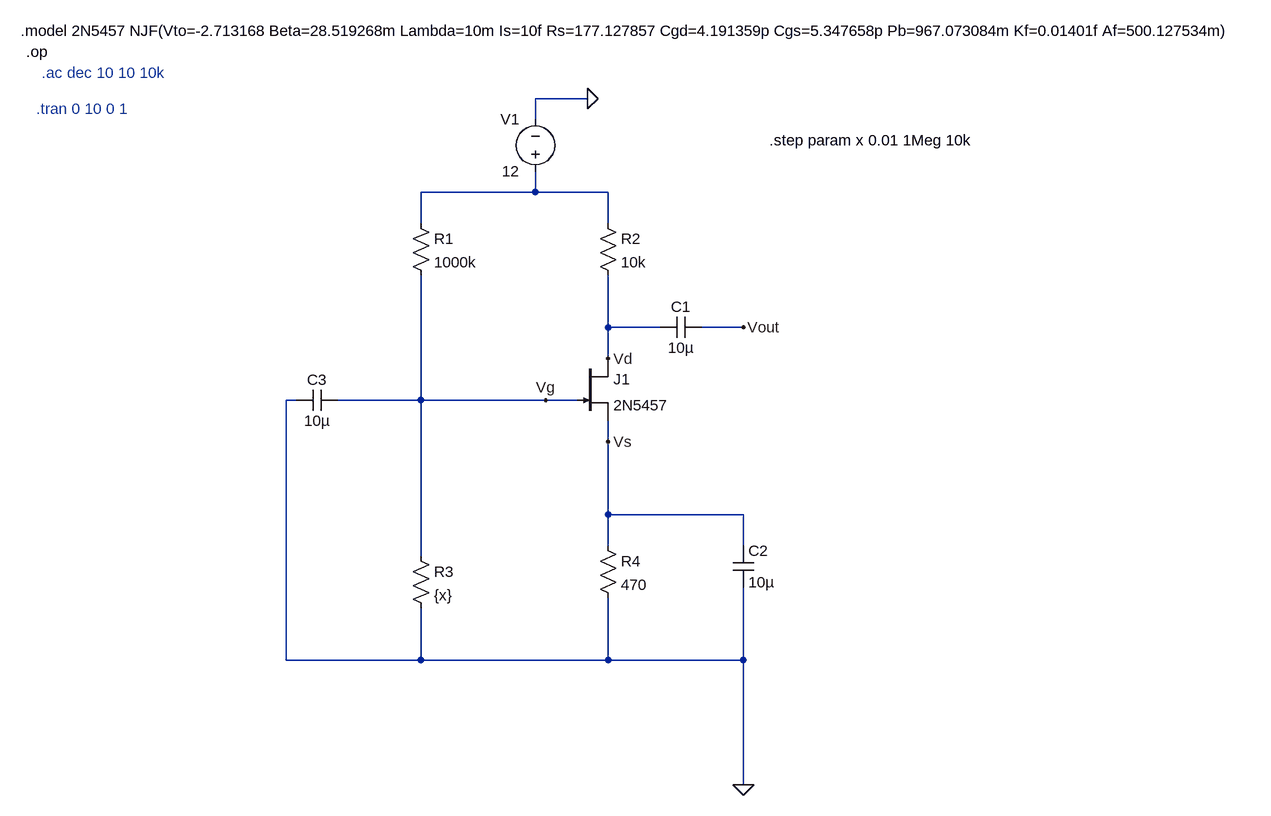
[diagram p0: schematic Draft8.asc]
Draft8.asc, the LTspice schematic file:
Version 4.1
SHEET 1 1468 1124
WIRE 224 48 144 48
WIRE 144 80 144 48
WIRE 144 192 144 160
WIRE 144 192 -32 192
WIRE 256 192 144 192
WIRE -32 240 -32 192
WIRE 256 240 256 192
WIRE 256 400 256 320
WIRE 336 400 256 400
WIRE 464 400 400 400
WIRE 256 448 256 400
WIRE -224 512 -240 512
WIRE -32 512 -32 320
WIRE -32 512 -160 512
WIRE 160 512 -32 512
WIRE 208 512 160 512
WIRE 256 576 256 544
WIRE 256 688 256 576
WIRE 464 688 256 688
WIRE 256 736 256 688
WIRE 464 736 464 688
WIRE -32 752 -32 512
WIRE -240 912 -240 512
WIRE -32 912 -32 832
WIRE -32 912 -240 912
WIRE 256 912 256 816
WIRE 256 912 -32 912
WIRE 464 912 464 800
WIRE 464 912 256 912
WIRE 464 1104 464 912
FLAG 224 48 0
FLAG 464 1104 0
FLAG 464 400 Vout
FLAG 160 512 Vg
FLAG 256 448 Vd
FLAG 256 576 Vs
SYMBOL res -48 224 R0
SYMATTR InstName R1
SYMATTR Value 1000k
SYMBOL res 240 224 R0
SYMATTR InstName R2
SYMATTR Value 10k
SYMBOL res -48 736 R0
SYMATTR InstName R3
SYMATTR Value {x}
SYMBOL njf 208 448 R0
SYMATTR InstName J1
SYMATTR Value 2N5457
SYMBOL res 240 720 R0
SYMATTR InstName R4
SYMATTR Value 470
SYMBOL voltage 144 176 R180
WINDOW 0 24 96 Left 2
WINDOW 3 24 16 Left 2
SYMATTR InstName V1
SYMATTR Value 12
SYMBOL cap 400 384 R90
WINDOW 0 0 32 VBottom 2
WINDOW 3 32 32 VTop 2
SYMATTR InstName C1
SYMATTR Value 10µ
SYMBOL cap 448 736 R0
SYMATTR InstName C2
SYMATTR Value 10µ
SYMBOL cap -160 496 R90
WINDOW 0 0 32 VBottom 2
WINDOW 3 32 32 VTop 2
SYMATTR InstName C3
SYMATTR Value 10µ
TEXT -648 -56 Left 2 !.model 2N5457 NJF(Vto=-2.713168 Beta=28.519268m Lambda=10m Is=10f Rs=177.127857 Cgd=4.191359p Cgs=5.347658p Pb=967.073084m Kf=0.01401f Af=500.127534m)
TEXT -640 -24 Left 2 !.op
TEXT 504 112 Left 2 !.step param x 0.01 1Meg 10k
TEXT -624 64 Left 2 ;.tran 0 10 0 1
TEXT -616 8 Left 2 ;.ac dec 10 10 10k

The netlist it stands for:
* Draft8.asc
R1 N001 Vg 1000k
R2 N001 Vd 10k
R3 Vg 0 {x}
J1 Vd Vg Vs 2N5457
R4 Vs 0 470
V1 N001 0 12
C1 Vout Vd 10µ
C2 Vs 0 10µ
C3 Vg 0 10µ
.model NJF NJF
.model PJF PJF
.lib standard.jft
.model 2N5457 NJF(Vto=-2.713168 Beta=28.519268m Lambda=10m Is=10f Rs=177.127857 Cgd=4.191359p Cgs=5.347658p Pb=967.073084m Kf=0.01401f Af=500.127534m)
.op
.step param x 0.01 1Meg 10k
* .tran 0 10 0 1
* .ac dec 10 10 10k
.backanno
.end